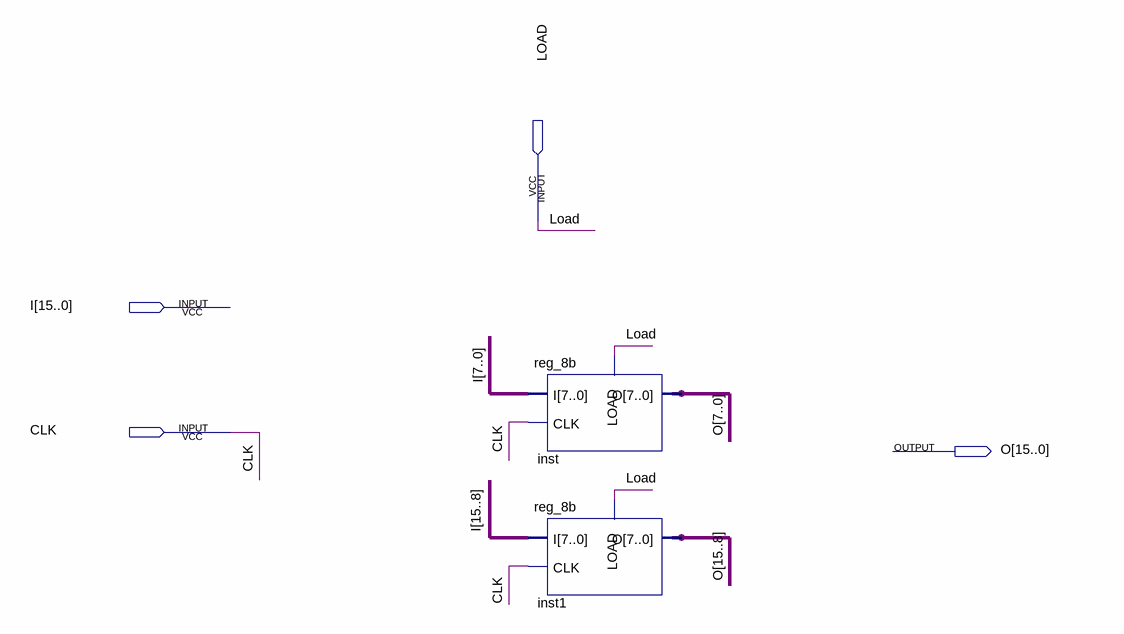
[diagram p0: schematic sheet]
// Quartus schematic reg_16b.bdf as structural Verilog: 2 symbols, 4 pins
module reg_16b (
  input  LOAD,
  input  [15:0] I,
  input  CLK,
  output [15:0] O
);

  reg_8b inst (.LOAD(LOAD), .I(I[7:0]), .CLK(CLK), .O(O[7:0]));
  reg_8b inst1 (.LOAD(LOAD), .I(I[15:8]), .CLK(CLK), .O(O[15:8]));
endmodule
